# Altium schematic sheet DigitalIO.SchDoc
size 420 x 297 mm; SheetNumber: 4; SheetTotal: 4
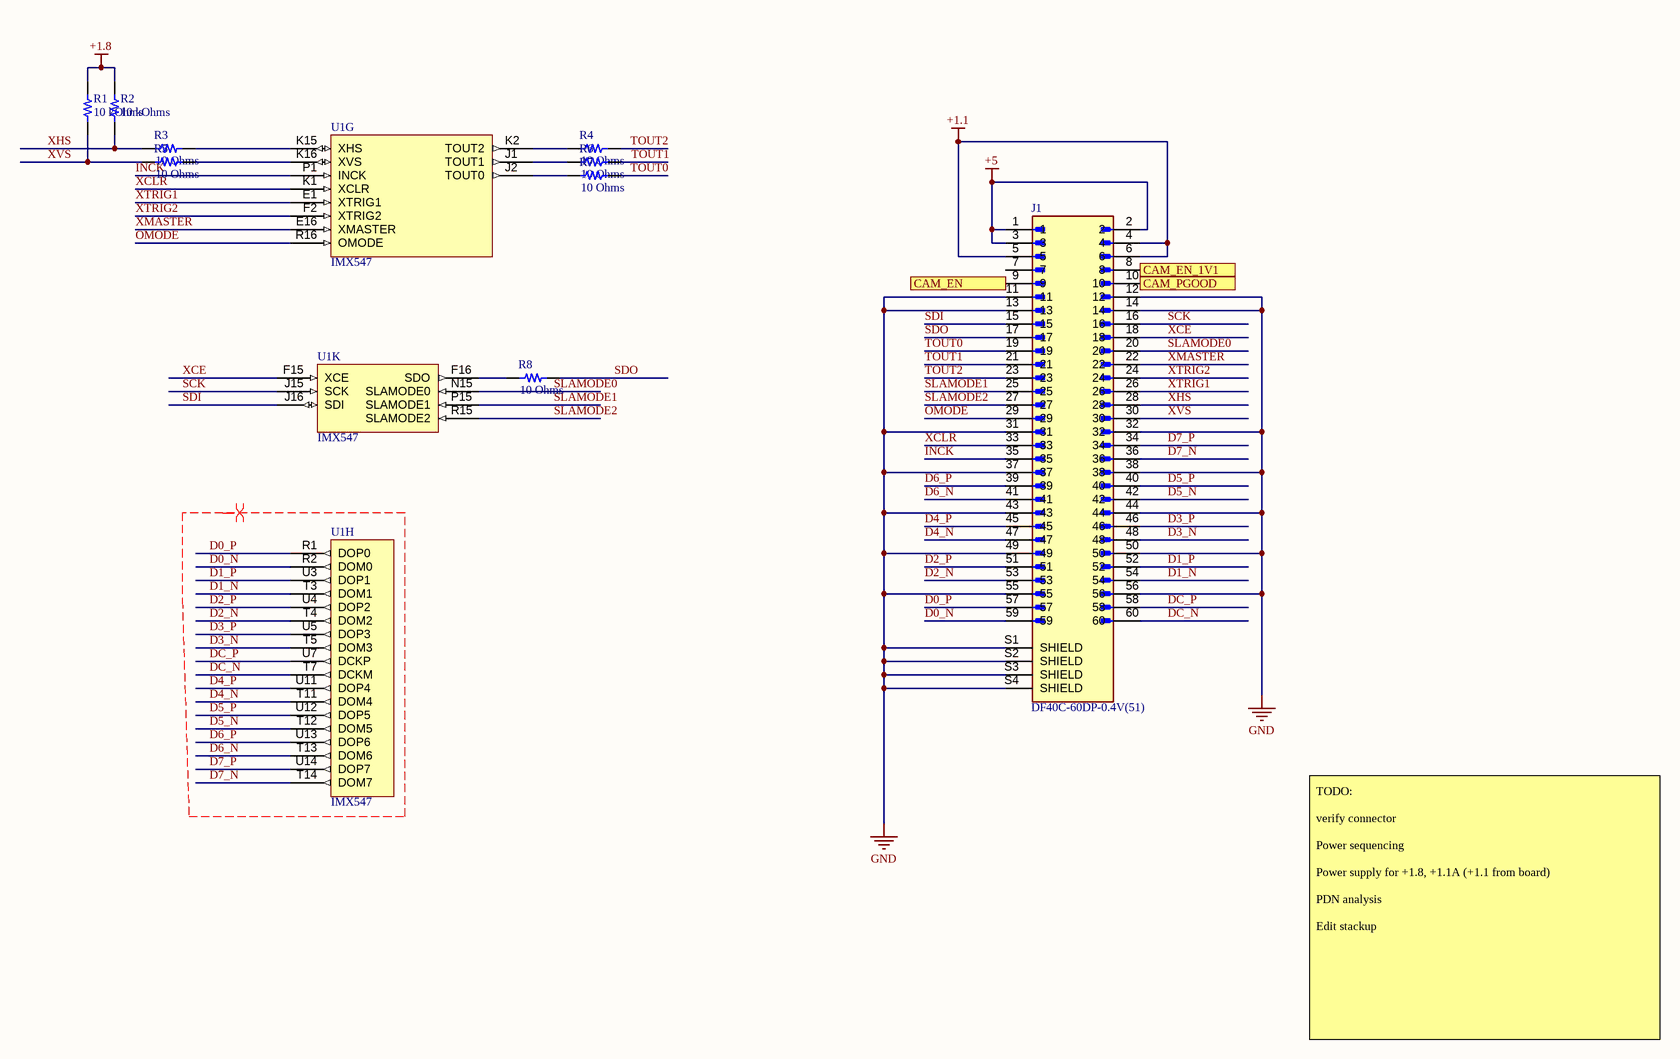
[diagram p0: DigitalIO.SchDoc]

## Parts
J1  DF40C-60DP-0.4V(51)  [HIROSE_DF40C-60DP-0.4V(51)]
R1  10 kOhms  [RES 0201_0603]
R2  10 kOhms  [RES 0201_0603]
R3  10 Ohms  [RES 0201_0603]
R4  10 Ohms  [RES 0201_0603]
R5  10 Ohms  [RES 0201_0603]
R6  10 Ohms  [RES 0201_0603]
R7  10 Ohms  [RES 0201_0603]
R8  10 Ohms  [RES 0201_0603]
U1  IMX547  [LGA230C100P16X17_1680X2000X260]  (parts G,H,K of 11)

## Ports
CAM_EN (out), CAM_EN_1V1 (in), CAM_PGOOD (in)

## Nets
+1.1: J1.4 J1.5 J1.6
+1.8: R1.2 R2.2
+5: J1.1 J1.2 J1.3
GND: J1.11 J1.12 J1.13 J1.14 J1.31 J1.32 J1.37 J1.38 J1.43 J1.44 J1.49 J1.50 J1.55 J1.56 J1.S1(SHIELD) J1.S2(SHIELD) J1.S3(SHIELD) J1.S4(SHIELD)
CAM_EN: J1.9 ; port CAM_EN
CAM_EN_1V1: J1.8 ; port CAM_EN_1V1
CAM_PGOOD: J1.10 ; port CAM_PGOOD
D0_N: J1.59 U1.R2(DOM0)
D0_P: J1.57 U1.R1(DOP0)
D1_N: J1.54 U1.T3(DOM1)
D1_P: J1.52 U1.U3(DOP1)
D2_N: J1.53 U1.T4(DOM2)
D2_P: J1.51 U1.U4(DOP2)
D3_N: J1.48 U1.T5(DOM3)
D3_P: J1.46 U1.U5(DOP3)
D4_N: J1.47 U1.T11(DOM4)
D4_P: J1.45 U1.U11(DOP4)
D5_N: J1.42 U1.T12(DOM5)
D5_P: J1.40 U1.U12(DOP5)
D6_N: J1.41 U1.T13(DOM6)
D6_P: J1.39 U1.U13(DOP6)
D7_N: J1.36 U1.T14(DOM7)
D7_P: J1.34 U1.U14(DOP7)
DC_N: J1.60 U1.T7(DCKM)
DC_P: J1.58 U1.U7(DCKP)
INCK: J1.35 U1.P1(INCK)
OMODE: J1.29 U1.R16(OMODE)
SCK: J1.16 U1.J15(SCK)
SDI: J1.15 U1.J16(SDI)
SDO: J1.17 R8.2
SLAMODE0: J1.20 U1.N15(SLAMODE0)
SLAMODE1: J1.25 U1.P15(SLAMODE1)
SLAMODE2: J1.27 U1.R15(SLAMODE2)
TOUT0: J1.19 R7.2
TOUT1: J1.21 R6.2
TOUT2: J1.23 R4.2
XCE: J1.18 U1.F15(XCE)
XCLR: J1.33 U1.K1(XCLR)
XHS: J1.28 R2.1 R3.1
XMASTER: J1.22 U1.E16(XMASTER)
XTRIG1: J1.26 U1.E1(XTRIG1)
XTRIG2: J1.24 U1.F2(XTRIG2)
XVS: J1.30 R1.1 R5.1
NetR3_2: R3.2 U1.K15(XHS)
NetR4_1: R4.1 U1.K2(TOUT2)
NetR5_2: R5.2 U1.K16(XVS)
NetR6_1: R6.1 U1.J1(TOUT1)
NetR7_1: R7.1 U1.J2(TOUT0)
NetR8_1: R8.1 U1.F16(SDO)

Not connected (* = marked no-connect by the designer): J1 7

## Layout directives
differential pair; differential pair class SLVSEC; net class SLVSEC: D0_N, D0_P, D1_N, D1_P, D2_N, D2_P, D3_N, D3_P, D4_N, D4_P, D5_N, D5_P, D6_N, D6_P, D7_N, D7_P, DC_N, DC_P

## Notes on the sheet
- TODO:
  verify connector
  Power sequencing
  Power supply for +1.8, +1.1A (+1.1 from board)
  PDN analysis
  Edit stackup
- DWG NO:
- REVISION
- REV:
- DESCRIPTION
- DATE
- APPROVED
- ENG:
- APPROVALS
- PROJECT
- DSN:
- CHK:
- REFERENCE DOCUMENTS
- PROJECT REVISION:
- TITLE
- SimulaVR
- DOCUMENT REVISION:
- DESIGN ITEM:
- BOM:
- FAB DWG:
- PCB DWG:
- ASSY DWG:
- SCALE:
- A3
- SIZE
- CAGE CODE
- FILE NAME
- DWG NO.
- SHEET
- OF
- REV

## Library data of the parts
J1 = DF40C-60DP-0.4V(51): 60 Position Connector Plug, Outer Shroud Contacts Surface Mount Gold; MF: {'manufacturer': u'Hirose Electric'}; Price: None; Value: *; MP: DF40C-60DP-0.4V(51); Availability: Unavailable; Package: None
R1 R2 = RMCF0201JG10K0: RES 10K OHM 5% 1/20W 0201; Manufacturer: Stackpole Electronics Inc; Power (Watts): 0.05W, 1/20W; Temperature Coefficient: ±200ppm/°C; Part Number: RMCF0201JG10K0; Value: 10 kOhms; ComponentLink1Description: Datasheet; ComponentLink1URL: https://www.seielect.com/catalog/sei-rmcf_rmcp.pdf; ComponentLink2Description: DigiKey Link; ComponentLink2URL: https://www.digikey.com/en/products/detail/stackpole-electronics-inc/RMCF0201JG10K0/6053790; Composition: Thick Film; Device Package: 0201 (0603 Metric); Height - Seated (Max): 0.010" (0.26mm); LastUpdated: 19.09.2022 13:09:10; Lifecycle Status: Active; Minimum Order: 1; Number of Terminations: 2; Operating Temperature: -55°C ~ 155°C; Package / Case: 0201 (0603 Metric); Packaging: CutTape; PartId: 1335; Part Status: Active; Price: 0.01; Ratings: AEC-Q200; Resistance: 10 kOhms; Series: RMCF; Size / Dimension: 0.024" L x 0.012" W (0.60mm x 0.30mm); Supplier 1: DigiKey; Supplier Part Number 1: RMCF0201JG10K0CT-ND; Supplier Device Package: 0201; Tolerance: ±5%
R3-R8 = CRG0201F10R: RES SMD 10 OHM 1% 1/20W 0201; Manufacturer: TE Connectivity Passive Product; Power (Watts): 0.05W, 1/20W; Temperature Coefficient: ±400ppm/°C; Part Number: CRG0201F10R; Value: 10 Ohms; ComponentLink1Description: Datasheet; ComponentLink1URL: https://www.te.com/commerce/DocumentDelivery/DDEController?Action=srchrtrv&DocNm=1773204&DocType=DS&DocLang=English; ComponentLink2Description: DigiKey Link; ComponentLink2URL: https://www.digikey.com/en/products/detail/te-connectivity-passive-product/CRG0201F10R/4489648; Composition: Thick Film; Device Package: 0201 (0603 Metric); Height - Seated (Max): 0.010" (0.26mm); LastUpdated: 8/11/2022 9:03:27 AM; Lifecycle Status: Active; Minimum Order: 1; Number of Terminations: 2; Operating Temperature: -55°C ~ 155°C; Package / Case: 0201 (0603 Metric); Packaging: TapeAndReel; PartId: 3; Part Status: Active; Price: 0.03; Resistance: 10 Ohms; Series: CRG, Neohm; Size / Dimension: 0.024" L x 0.012" W (0.60mm x 0.30mm); Supplier 1: DigiKey; Supplier Part Number 1: A129573CT-ND; Supplier Device Package: 0201; Tolerance: ±1%
U1 = CMP-001-0000-4: Sony IMX547 sensor